# EAGLE design Ardev version 3 (EAGLE 6.4)
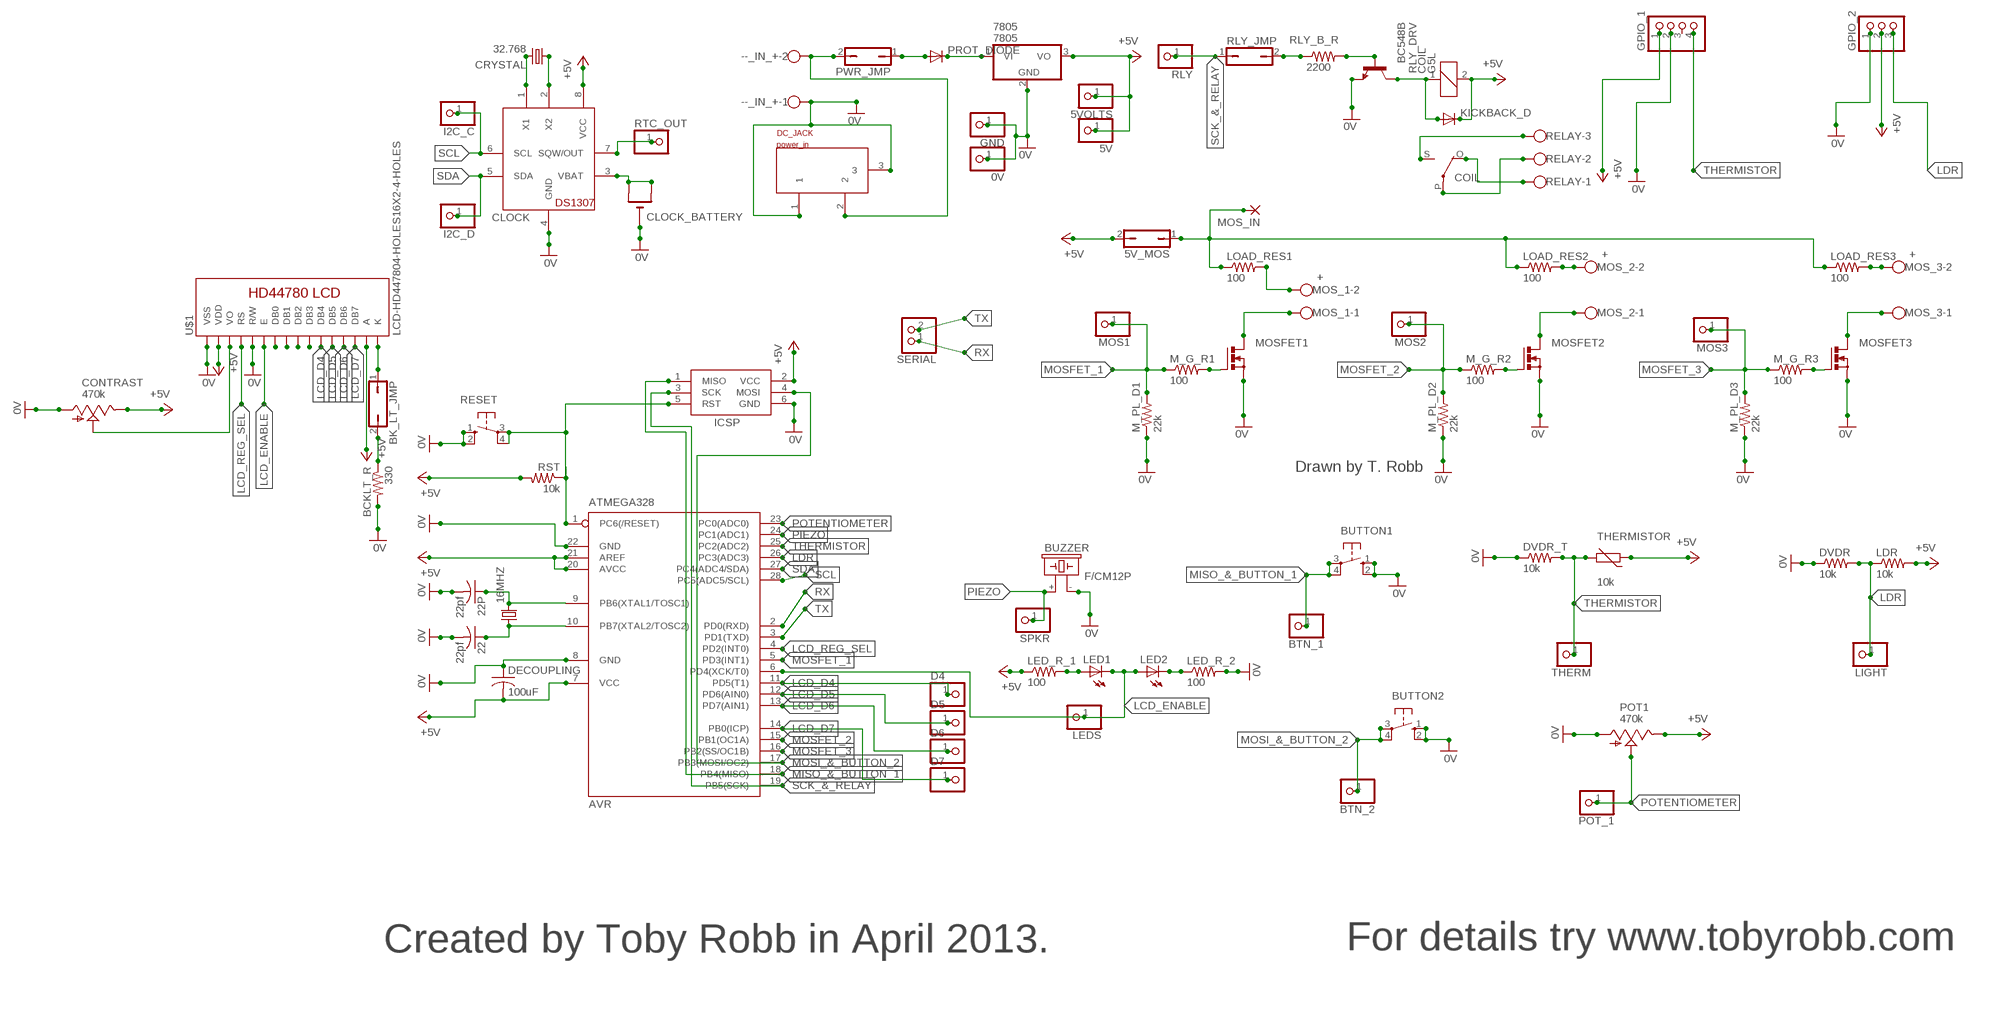
[diagram p0: schematic, sheet 1, part 1 of 2]
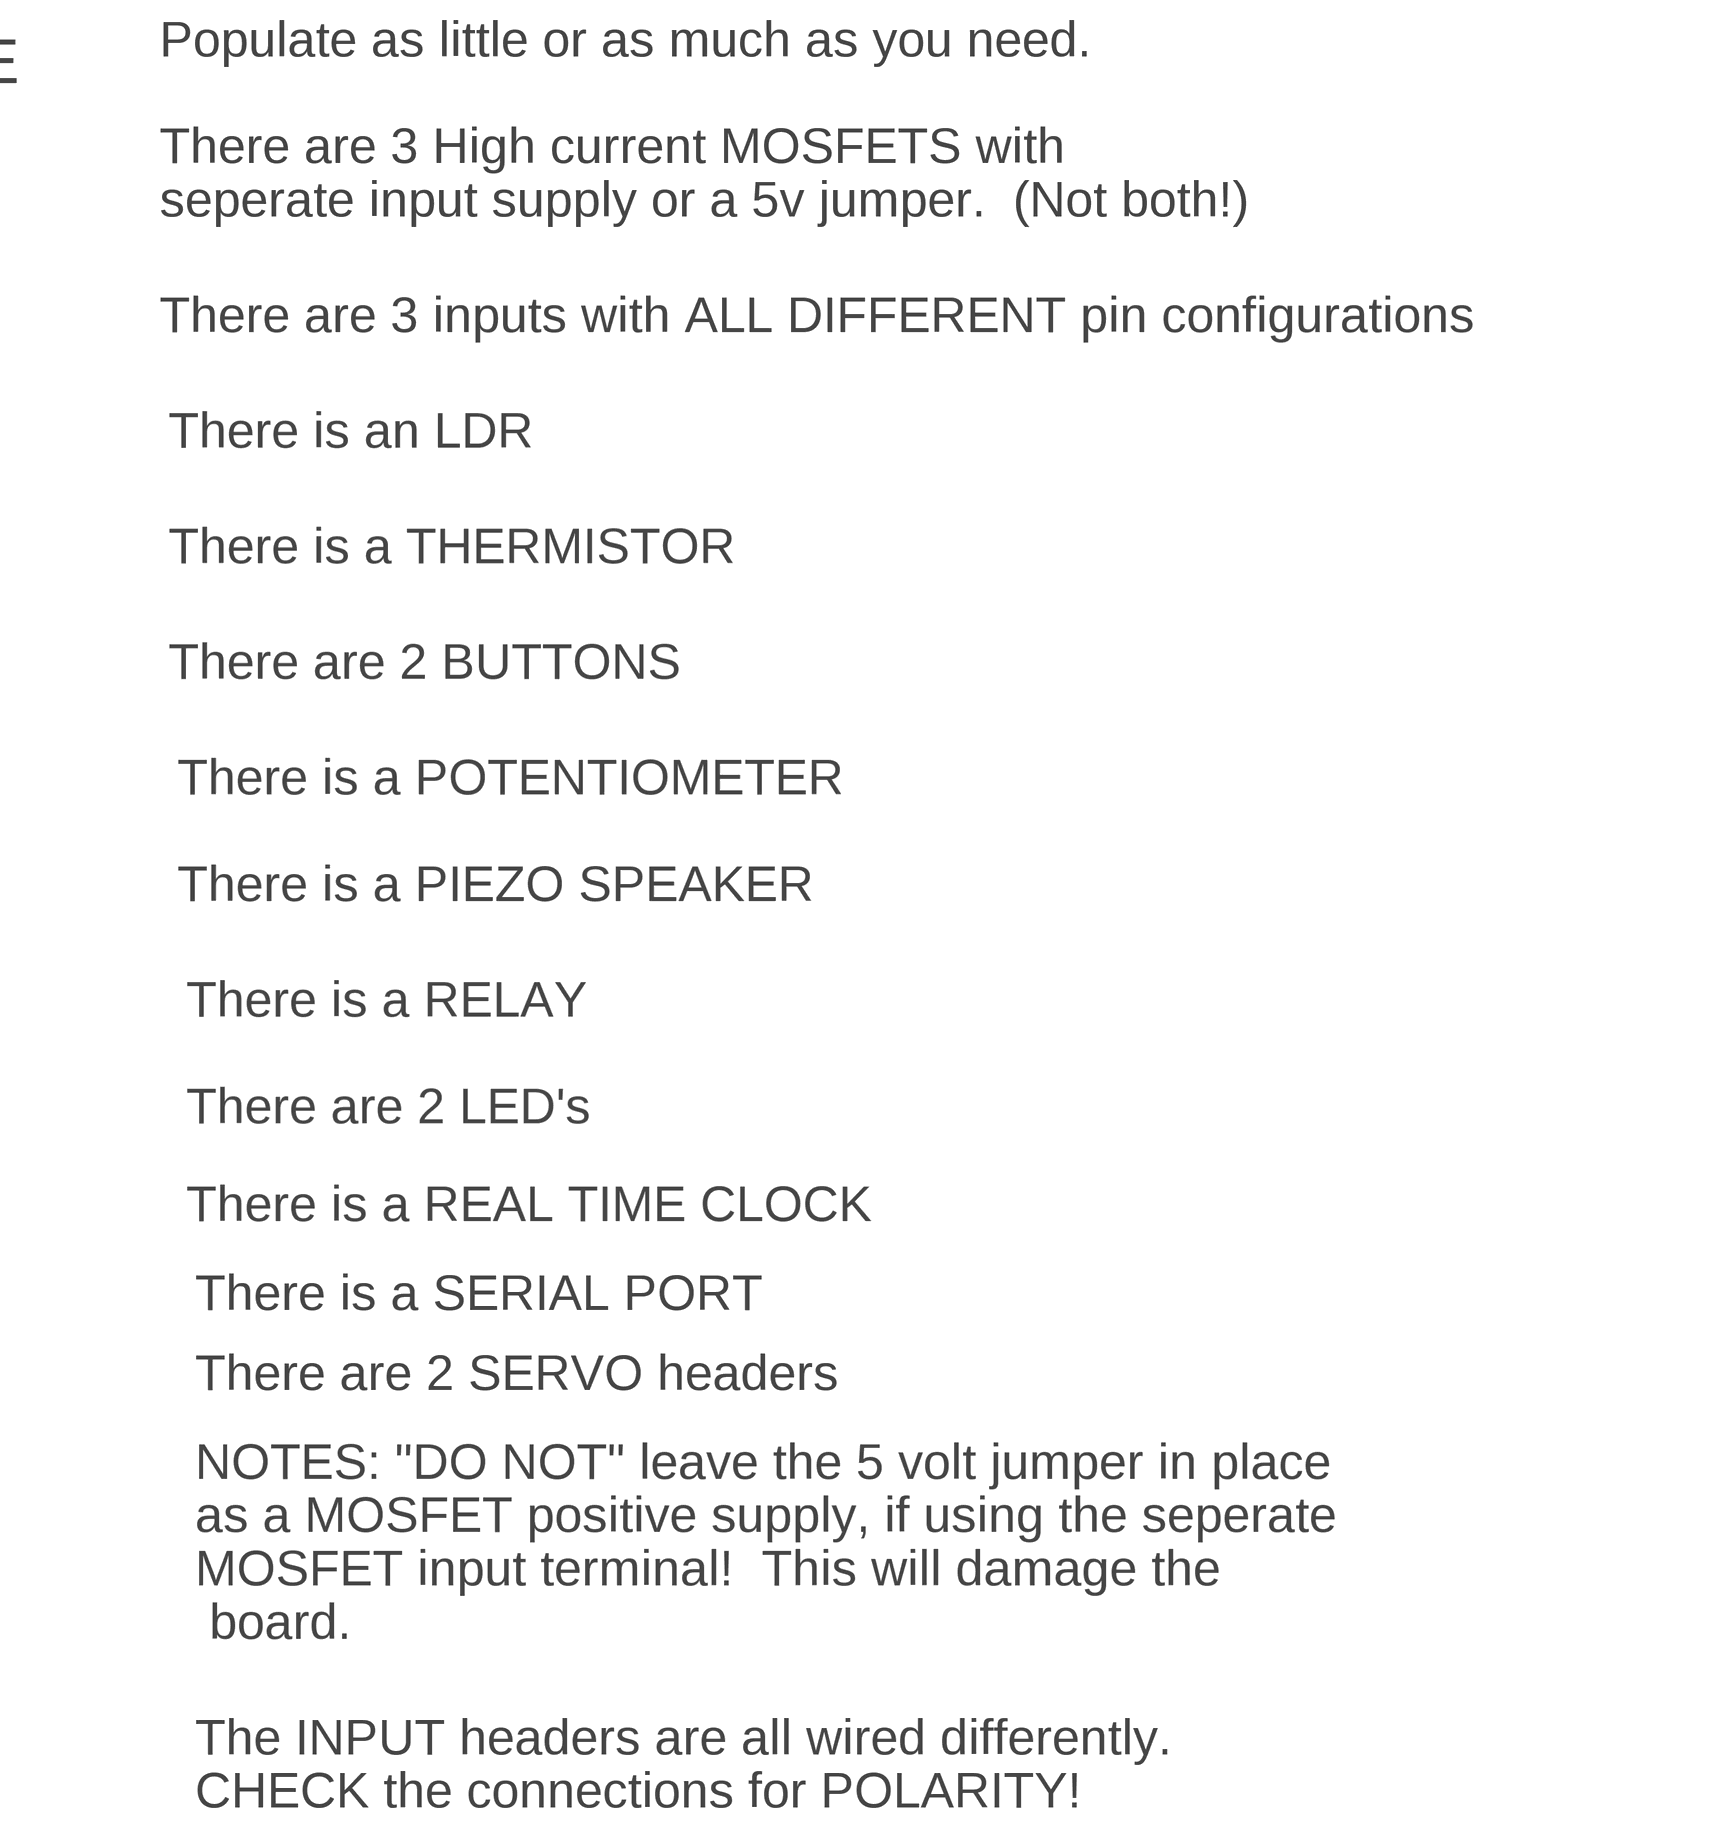
[diagram p1: schematic, sheet 1, part 2 of 2]

## Parts
0V  PINHD-1X1  [1X01]
5V  PINHD-1X1  [1X01]
5V_MOS  JP1Q  [JP1]
5VOLTS  PINHD-1X1  [1X01]
16MHZ  CRYSTALHC49U-V  [HC49U-V]
22  22pf  C-US025-050X050  [C025-050X050]
22P  22pf  C-US025-050X050  [C025-050X050]
7805  7805  7805TV  [TO220V]
--_IN_+  W237-102  [W237-102]
AVR  ATMEGA328  MEGA8-P  [DIL28-3]
BCKLT_R  330  R-US_0309/V  [0309V]
BK_LT_JMP  JP1Q  [JP1]
BTN_1  PINHD-1X1  [1X01]
BTN_2  PINHD-1X1  [1X01]
BUTTON1  10-XX  [B3F-10XX]
BUTTON2  10-XX  [B3F-10XX]
BUZZER  F/CM12P  [F/CM12P]
CLOCK  DS1307  [DIL08]
CLOCK_BATTERY  CR1220THM  [CR1220-THM]
COIL  G5L  [G5LE]
CONTRAST  470k  TRIM_US-CA6V  [CA6V]
CRYSTAL  32.768  CRYSTALTC26H  [TC26H]
D4  PINHD-1X1  [1X01]
D5  PINHD-1X1  [1X01]
D6  PINHD-1X1  [1X01]
D7  PINHD-1X1  [1X01]
DC_JACK  power_in  SMARTPRJ_POWERSUPPLY_DC21MMX  [SMARTPRJ_POWERSUPPLY_DC-21MM]
DECOUPLING  100uF  C-US025-050X050  [C025-050X050]
DVDR  10k  R-US_0309/V  [0309V]
DVDR_T  10k  R-US_0309/V  [0309V]
GND  PINHD-1X1  [1X01]
GPIO_1  PINHD-1X4  [1X04]
GPIO_2  PINHD-1X3  [1X03]
I2C_C  PINHD-1X1  [1X01]
I2C_D  PINHD-1X1  [1X01]
ICSP  AVRISP-6  [AVRISP]
KICKBACK_D  DIODE-D-7.5  [D-7.5]
LDR  10k  R-US_0309/V  [0309V]
LED1  LED5MM  [LED5MM]
LED2  LED5MM  [LED5MM]
LED_R_1  100  R-US_0207/2V  [0207/2V]
LED_R_2  100  R-US_0207/2V  [0207/2V]
LEDS  PINHD-1X1  [1X01]
LIGHT  PINHD-1X1  [1X01]
LOAD_RES1  100  R-US_0309/V  [0309V]
LOAD_RES2  100  R-US_0309/V  [0309V]
LOAD_RES3  100  R-US_0309/V  [0309V]
M_G_R1  100  R-US_0309/V  [0309V]
M_G_R2  100  R-US_0309/V  [0309V]
M_G_R3  100  R-US_0309/V  [0309V]
M_PL_D1  22k  R-US_0309/V  [0309V]
M_PL_D2  22k  R-US_0309/V  [0309V]
M_PL_D3  22k  R-US_0309/V  [0309V]
MOS1  PINHD-1X1  [1X01]
MOS2  PINHD-1X1  [1X01]
MOS3  PINHD-1X1  [1X01]
MOS_1  +  W237-102  [W237-102]
MOS_2  +  W237-102  [W237-102]
MOS_3  +  W237-102  [W237-102]
MOS_IN  3,17/1,3  [3,17/1,3]
MOSFET1  IRF512  [TO220BV]
MOSFET2  IRF512  [TO220BV]
MOSFET3  IRF512  [TO220BV]
POT1  470k  TRIM_US-CA6V  [CA6V]
POT_1  PINHD-1X1  [1X01]
PROT_DIODE  DIODE-D-7.5  [D-7.5]
PWR_JMP  JP1Q  [JP1]
RELAY  W237-103  [W237-103]
RESET  10-XX  [B3F-10XX]
RLY  PINHD-1X1  [1X01]
RLY_B_R  2200  R-US_0309/V  [0309V]
RLY_DRV  BC548B  [TO92-EBC]
RLY_JMP  JP1Q  [JP1]
RST  10k  R-US_0309/V  [0309V]
RTC_OUT  PINHD-1X1  [1X01]
SERIAL  PINHD-1X2  [1X02]
SPKR  PINHD-1X1  [1X01]
THERM  PINHD-1X1  [1X01]
THERMISTOR  10k  THERMISTOR_R-2,5  [RS-2,5]
U$1  LCD-HD447804-HOLES16X2-4-HOLES  [LCD-16X2-4HOLES]

## Nets
0V: 0V.1 22.2 22P.2 7805.2(GND) --_IN_+.1 AVR.8(GND) AVR.22(GND) BCKLT_R.2 BUTTON1.1(S) BUTTON1.2(S1) BUTTON2.1(S) BUTTON2.2(S1) BUZZER.- CLOCK.4(GND) CLOCK_BATTERY.- CONTRAST.A DC_JACK.1 DC_JACK.3 DECOUPLING.1 DVDR.1 DVDR_T.1 GND.1 GPIO_1.2 GPIO_2.1 ICSP.6(GND) LED_R_2.2 M_PL_D1.1 M_PL_D2.1 M_PL_D3.1 MOSFET1.S MOSFET2.S MOSFET3.S POT1.A RESET.1(S) RESET.2(S1) RLY_DRV.E U$1.1(VSS) U$1.5(R/W)
+5V: 5V.1 5V_MOS.2 5VOLTS.1 7805.3(VO) AVR.7(VCC) AVR.20(AVCC) AVR.21(AREF) CLOCK.8(VCC) COIL.2 CONTRAST.E DECOUPLING.2 GPIO_1.1 GPIO_2.2 ICSP.2(VCC) KICKBACK_D.C LDR.2 LED_R_1.1 POT1.E RST.2 THERMISTOR.1 U$1.2(VDD) U$1.15(A)
LCD_D4: AVR.11(PD5(T1)) D4.1 U$1.11(DB4)
LCD_D5: AVR.12(PD6(AIN0)) D5.1 U$1.12(DB5)
LCD_D6: AVR.13(PD7(AIN1)) D6.1 U$1.13(DB6)
LCD_D7: AVR.14(PB0(ICP)) D7.1 U$1.14(DB7)
LCD_ENABLE: AVR.6(PD4(XCK/T0)) LED1.K(C) LED2.A LEDS.1 U$1.6(E)
LCD_REG_SEL: AVR.4(PD2(INT0)) U$1.4(RS)
LDR: AVR.26(PC3(ADC3)) DVDR.2 GPIO_2.3 LDR.1 LIGHT.1
MISO_&_BUTTON_1: AVR.18(PB4(MISO)) BTN_1.1 BUTTON1.3(P) BUTTON1.4(P1) ICSP.1(MISO)
MOSFET_1: AVR.5(PD3(INT1)) M_G_R1.1 M_PL_D1.2 MOS1.1
MOSFET_2: AVR.15(PB1(OC1A)) M_G_R2.1 M_PL_D2.2 MOS2.1
MOSFET_3: AVR.16(PB2(SS/OC1B)) M_G_R3.1 M_PL_D3.2 MOS3.1
MOSI_&_BUTTON_2: AVR.17(PB3(MOSI/OC2)) BTN_2.1 BUTTON2.3(P) BUTTON2.4(P1) ICSP.4(MOSI)
N$1: --_IN_+.2 DC_JACK.2 PWR_JMP.2
N$2: PROT_DIODE.A PWR_JMP.1
N$3: AVR.1(PC6(/RESET)) ICSP.5(RST) RESET.3(P) RESET.4(P1) RST.1
N$4: 7805.1(VI) PROT_DIODE.C
N$5: LOAD_RES1.2 MOS_1.2
N$6: MOS_1.1 MOSFET1.D
N$7: 16MHZ.2 22P.1 AVR.9(PB6(XTAL1/TOSC1))
N$8: LOAD_RES3.2 MOS_3.2
N$9: MOS_3.1 MOSFET3.D
N$10: 16MHZ.1 22.1 AVR.10(PB7(XTAL2/TOSC2))
N$11: LOAD_RES2.2 MOS_2.2
N$12: MOS_2.1 MOSFET2.D
N$13: CLOCK.2(X2) CRYSTAL.1
N$14: CLOCK.1(X1) CRYSTAL.2
N$15: CLOCK.3(VBAT) CLOCK_BATTERY.+1(+) CLOCK_BATTERY.+2(+1)
N$16: LED1.A LED_R_1.2
N$17: COIL.O(2:O) RELAY.1
N$18: COIL.P(2:P) RELAY.2
N$19: COIL.S(2:S) RELAY.3
N$20: 5V_MOS.1 LOAD_RES1.1 LOAD_RES2.1 LOAD_RES3.1 MOS_IN.1(P)
N$21: LED2.K(C) LED_R_2.1
N$22: CLOCK.7(SQW/OUT) RTC_OUT.1
N$23: COIL.1 KICKBACK_D.A RLY_DRV.C
N$24: M_G_R3.2 MOSFET3.G
N$25: CONTRAST.S U$1.3(VO)
N$26: U$1.7(DB0)
N$27: U$1.8(DB1)
N$28: U$1.9(DB2)
N$29: U$1.10(DB3)
N$30: M_G_R2.2 MOSFET2.G
N$31: M_G_R1.2 MOSFET1.G
N$32: BK_LT_JMP.1 U$1.16(K)
N$33: BCKLT_R.1 BK_LT_JMP.2
N$34: RLY_B_R.2 RLY_DRV.B
N$35: RLY_B_R.1 RLY_JMP.2
PIEZO: AVR.24(PC1(ADC1)) BUZZER.+ SPKR.1
POTENTIOMETER: AVR.23(PC0(ADC0)) POT1.S POT_1.1
RX: AVR.2(PD0(RXD)) SERIAL.1
SCK_&_RELAY: AVR.19(PB5(SCK)) ICSP.3(SCK) RLY.1 RLY_JMP.1
SCL: AVR.28(PC5(ADC5/SCL)) CLOCK.6(SCL) I2C_C.1
SDA: AVR.27(PC4(ADC4/SDA)) CLOCK.5(SDA) I2C_D.1
THERMISTOR: AVR.25(PC2(ADC2)) DVDR_T.2 GPIO_1.4 THERM.1 THERMISTOR.2
TX: AVR.3(PD1(TXD)) SERIAL.2
Unconnected: GPIO_1.3

## Notes on the sheet
- This is a development board for the ATMEGA328 programmed through the ARDUINO IDE
- Populate as little or as much as you need.
  
  There are 3 High current MOSFETS with
  seperate input supply or a 5v jumper.
- (Not both!)
- There are 3 inputs with ALL DIFFERENT pin configurations
- There is an LDR
- There is a THERMISTOR
- There are 2 BUTTONS
- There is a POTENTIOMETER
- There is a PIEZO SPEAKER
- Drawn by T. Robb | There is a RELAY
- There are 2 LED's
- There is a REAL TIME CLOCK
- There is a SERIAL PORT
- There are 2 SERVO headers
- NOTES: "DO NOT" leave the 5 volt jumper in place
  as a MOSFET positive supply, if using the seperate
  MOSFET input terminal!  This will damage the
   board.
- For details try www.tobyrobb.com
- The INPUT headers are all wired differently.
  CHECK the connections for POLARITY!
- Created by Toby Robb in April 2013.

## Library data of the parts
0V 5V 5VOLTS BTN_1 BTN_2 D4-D7 GND I2C_C I2C_D LEDS LIGHT MOS1-MOS3 POT_1 RLY RTC_OUT SPKR THERM = pinhead:PINHD-1X1: PIN HEADER
5V_MOS BK_LT_JMP PWR_JMP RLY_JMP = jumper:JP1Q: JUMPER
16MHZ = crystal:CRYSTAL: CRYSTAL; OC_FARNELL: 1666969; OC_NEWARK: unknown
22 22P DECOUPLING = rcl:C-US: CAPACITOR, American symbol
7805 = linear:78*: Positive VOLTAGE REGULATOR Source: http://cache.national.com/ds/LM/LM78L05.pdf http://www.fairchildsemi.com/ds/LM/LM7805.pdf
--_IN_+ MOS_1-MOS_3 = con-wago-500:W237-102: WAGO SCREW CLAMP; MPN: 237-102; OC_FARNELL: unknown; OC_NEWARK: 70K9898
AVR = atmel:MEGA8-P: MICROCONTROLLER 8 Kbytes FLASH, 1 kbytes SRAM, 512 bytes EEPROM, USART, 4-channel 10 bit ADC, 2-channel 8 bit ADC Pin compatible with Atmega48, ATMega88, ATMega168 Source: avr.lbr; OC_FARNELL: unknown; OC_NEWARK: unknown
BCKLT_R DVDR DVDR_T LDR LED_R_1 LED_R_2 LOAD_RES1-LOAD_RES3 M_G_R1-M_G_R3 M_PL_D1-M_PL_D3 RLY_B_R RST = rcl:R-US_: RESISTOR, American symbol
BUTTON1 BUTTON2 RESET = switch-omron:10-XX: OMRON SWITCH; MPN: B3F-1000; OC_FARNELL: 176432; OC_NEWARK: 36M3542
BUZZER = buzzer:F/CM12P: BUZZER Source: Buerklin; OC_FARNELL: unknown; OC_NEWARK: unknown
CLOCK = adafruit:DS1307: DS1307 Real time clock (RTC) with battery backup ability. Talk to it via i2c
CLOCK_BATTERY = adafruit:CR1220: CR1216/CR1220/CR1225 12mm 3V lithium coin cell Great for battery packup. Both SMT and THM holders. Note the THM package has the ground pads on both sides of the PCB so that the masks are the same - this reduces the cost
COIL = relay:G5L: RELAY 1 x switch, 10 A/120 V AC, 8 A/30 V ADC, Omron; OC_FARNELL: unknown; OC_NEWARK: unknown
CONTRAST POT1 = pot:TRIM_US-: POTENTIOMETER
CRYSTAL = crystal:CRYSTAL: CRYSTAL; OC_FARNELL: unknown; OC_NEWARK: unknown
DC_JACK = arduino_Uno_Rev3-02-TH:SMARTPRJ_POWERSUPPLY_DC21MM
GPIO_1 = pinhead:PINHD-1X4: PIN HEADER
GPIO_2 = pinhead:PINHD-1X3: PIN HEADER
ICSP = adafruit:AVRISP: AVR ISP HEADER Standard 6 pin header for AVR programming
KICKBACK_D PROT_DIODE = diode:DIODE-: DIODE
LED1 LED2 = led:LED: LED OSRAM: - CHIPLED LG R971, LG N971, LY N971, LG Q971, LY Q971, LO R971, LY R971 LH N974, LH R974 LS Q976, LO Q976, LY Q976 LO Q996 - Hyper CHIPLED LW Q18S LB Q993, LB Q99A, LB R99A - SideLED LS A670, LO A670, LY A670, LG A670, LP A670 LB A673, LV A673, LT A673, LW A673 LH A674 LY A675 LS A676, LA A676, LO A676, LY A676, LW A676 LS A679, LY A679, LG A679 - Hyper Micro SIDELED® LS Y876, LA Y876, LO Y876, LY Y876 LT Y87S - SmartLED LW L88C, LW L88S LB L89C, LB L89S, LG L890 LS L89K, LO L89K, LY L89K LS L896, LA L896, LO L896, LY L896 - TOPLED LS T670, LO T670, LY T670, LG T670, LP T670 LSG T670, LSP T670, LSY T670, LOP T670, LYG T670 LG T671, LOG T671, LSG T671 LB T673, LV T673, LT T673, LW T673 LH T674 LS T676, LA T676, LO T676, LY T676, LB T676, LH T676, LSB T676, LW T676 LB T67C, LV T67C, LT T67C, LS T67K, LO T67K, LY T67K, LW E67C LS E67B, LA E67B, LO E67B, LY E67B, LB E67C, LV E67C, LT E67C LW T67C LS T679, LY T679, LG T679 LS T770, LO T770, LY T770, LG T770, LP T770 LB T773, LV T773, LT T773, LW T773 LH T774 LS E675, LA E675, LY E675, LS T675 LS T776, LA T776, LO T776, LY T776, LB T776 LHGB T686 LT T68C, LB T68C - Hyper Mini TOPLED® LB M676 - Mini TOPLED Santana® LG M470 LS M47K, LO M47K, LY M47K Source: http://www.osram.convergy.de LUXEON: - LUMILED® LXK2-PW12-R00, LXK2-PW12-S00, LXK2-PW14-U00, LXK2-PW14-V00 LXK2-PM12-R00, LXK2-PM12-S00, LXK2-PM14-U00 LXK2-PE12-Q00, LXK2-PE12-R00, LXK2-PE12-S00, LXK2-PE14-T00, LXK2-PE14-U00 LXK2-PB12-K00, LXK2-PB12-L00, LXK2-PB12-M00, LXK2-PB14-N00, LXK2-PB14-P00, LXK2-PB14-Q00 LXK2-PR12-L00, LXK2-PR12-M00, LXK2-PR14-Q00, LXK2-PR14-R00 LXK2-PD12-Q00, LXK2-PD12-R00, LXK2-PD12-S00 LXK2-PH12-R00, LXK2-PH12-S00 LXK2-PL12-P00, LXK2-PL12-Q00, LXK2-PL12-R00 Source: www.luxeon.com KINGBRIGHT: KA-3528ASYC Source: www.kingbright.com
MOS_IN = wirepad:3,17/1,3: THROUGH-HOLE PAD
MOSFET1-MOSFET3 = transistor-power:IRF512: N-CHANNEL MOS FET
RELAY = con-wago-500:W237-103: WAGO SCREW CLAMP; MPN: 237-103; OC_FARNELL: unknown; OC_NEWARK: 18M7116
RLY_DRV = transistor-npn:BC548*: NPN Transistor
SERIAL = pinhead:PINHD-1X2: PIN HEADER
THERMISTOR = discrete:THERMISTOR_: Thermo Resistor
U$1 = HD44780LCD:LCD-HD44780

## Net classes
0 default: clearance 0.355 mm

## Board
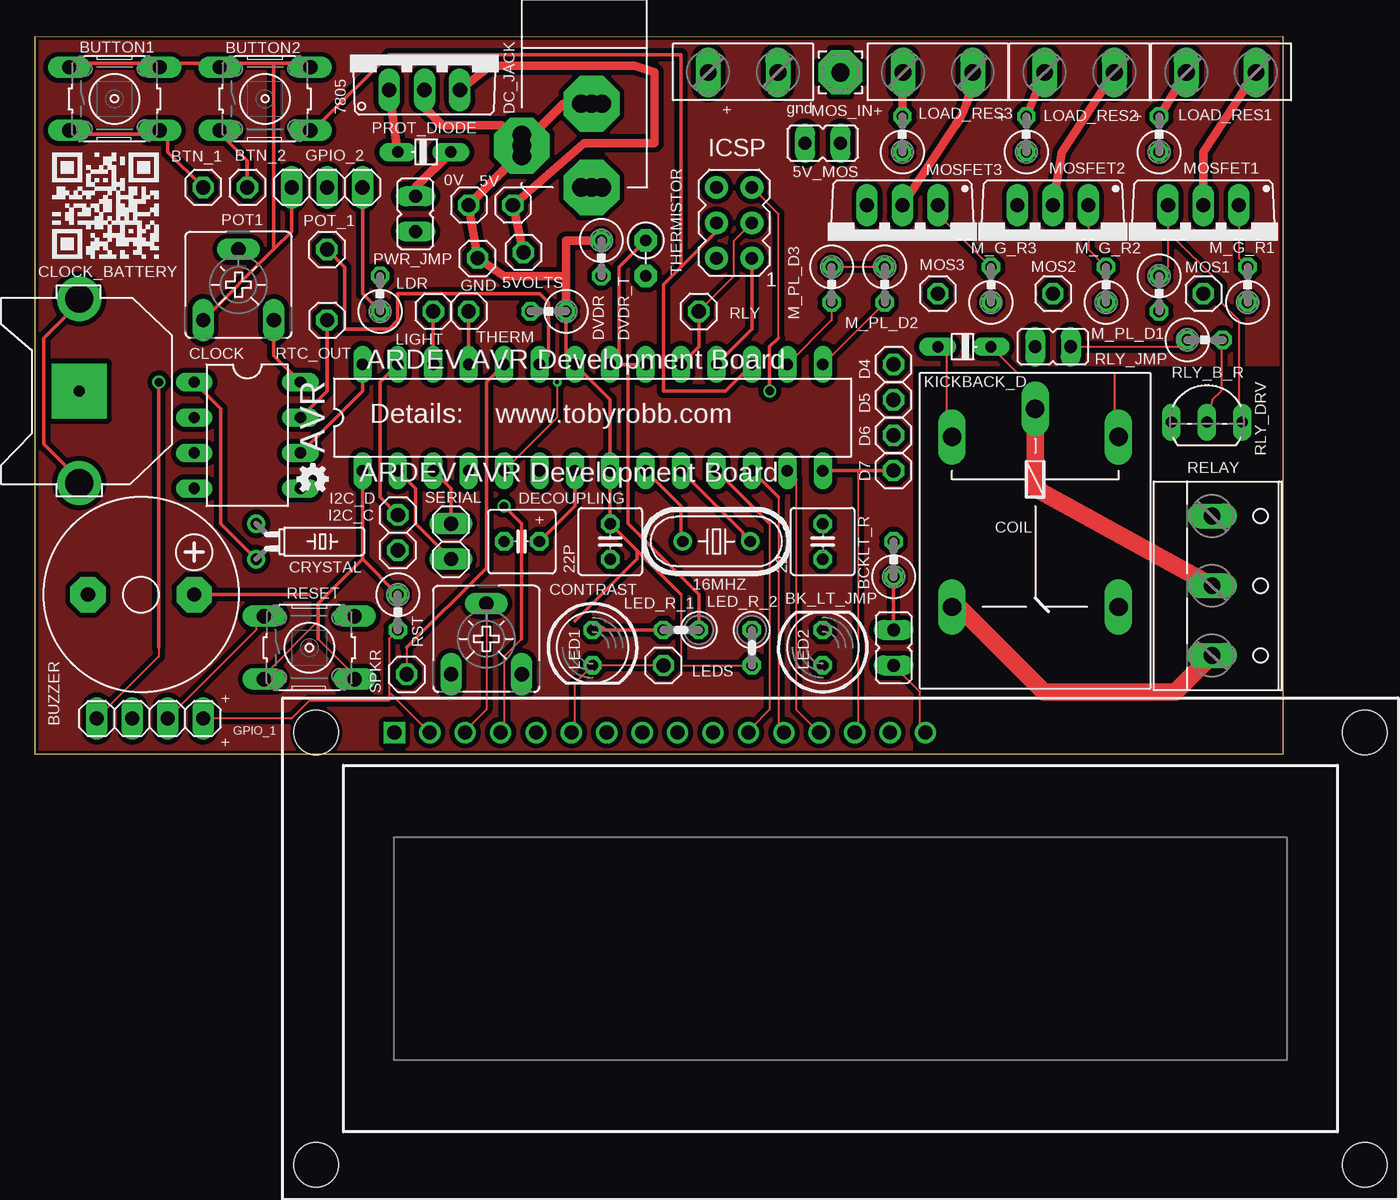
[diagram p2: board, top side]
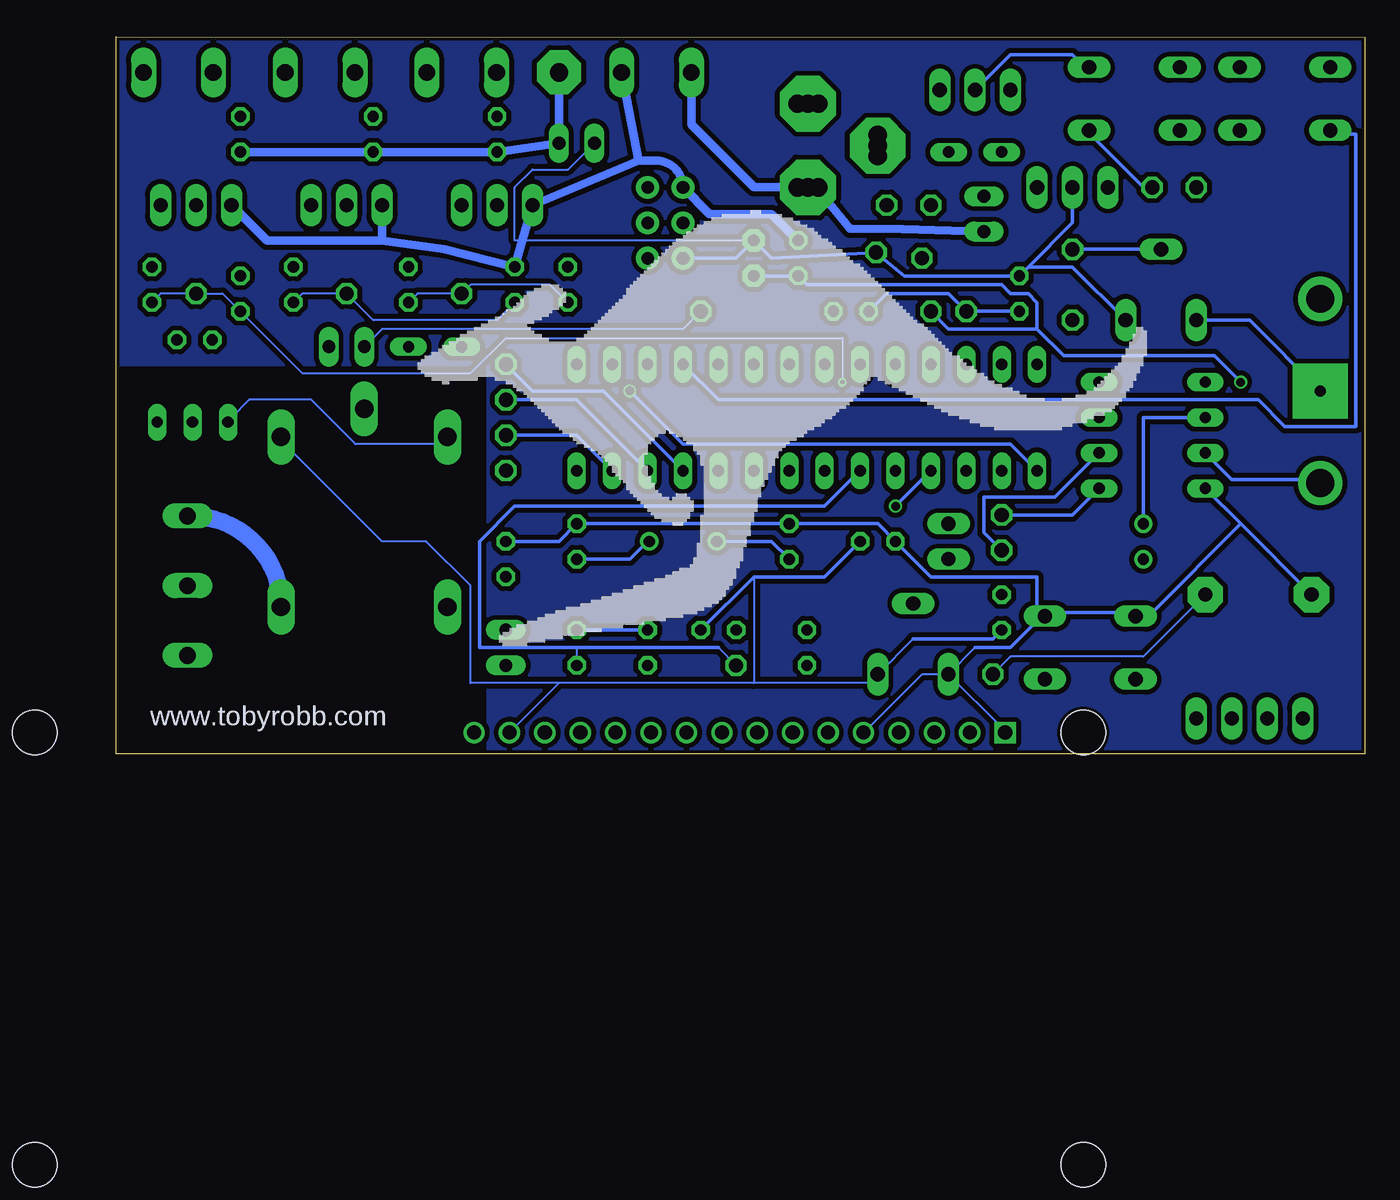
[diagram p3: board, bottom side, seen from below]

Size 89.53 x 51.44 mm. Coordinates in mm from the lower left corner, seen from the top.
Outline: 0,0 89.53,0 89.53,51.44 0,51.42 0,0
Copper layers (1*16): Top 0.035mm / dielectric 1.5mm / Bottom 0.035mm
Design rules "ITEADstudio_DRC": minimum track width 6mil, minimum drill 12mil, track to track 6mil, track to pad 6mil, pad to pad 6mil, via to via 6mil, smd to smd 0mil, copper to edge 10mil, drill to drill 10mil, minimum pad ring 10mil, minimum via ring 6mil, stop-mask expansion 2mil, vias tented up to drill 100mil, thermal gap 10mil

### Footprints (pad centres in the part's own frame; a part is rotated, then mirrored left to right if it is on the bottom)
1X01 = drill 1.016 octagon: 1 0,0
JP1 = drill 0.914 long: 1 0,-1.27; 2 0,1.27
HC49U-V = drill 0.813: 1 -2.413,0; 2 2.413,0
C025-050X050 = drill 0.813 octagon: 1 -1.27,0; 2 1.27,0
TO220V = drill 1.016 long: 1 -2.54,-2.54; 2 0,-2.54; 3 2.54,-2.54
W237-102 = drill 1.194 long: 1 -2.5,-1.27; 2 2.5,-1.27
DIL28-3 = drill 0.813 long: 1 -16.51,-3.81; 2 -13.97,-3.81; 3 -11.43,-3.81; 4 -8.89,-3.81; 5 -6.35,-3.81; 6 -3.81,-3.81; 7 -1.27,-3.81; 8 1.27,-3.81; 9 3.81,-3.81; 10 6.35,-3.81; 11 8.89,-3.81; 12 11.43,-3.81; 13 13.97,-3.81; 14 16.51,-3.81; 15 16.51,3.81; 16 13.97,3.81; 17 11.43,3.81; 18 8.89,3.81; 19 6.35,3.81; 20 3.81,3.81; 21 1.27,3.81; 22 -1.27,3.81; 23 -3.81,3.81; 24 -6.35,3.81; 25 -8.89,3.81; 26 -11.43,3.81; 27 -13.97,3.81; 28 -16.51,3.81
0309V = drill 0.813 octagon: 1 -1.27,0; 2 1.27,0
B3F-10XX = drill 1.016 long: 1 -3.251,2.261; 2 3.251,2.261; 3 -3.251,-2.261; 4 3.251,-2.261
F/CM12P = drill 1.016 pad 2.54 octagon: + 3.81,0; - -3.81,0
DIL08 = drill 0.813 long: 1 -3.81,-3.81; 2 -1.27,-3.81; 3 1.27,-3.81; 4 3.81,-3.81; 5 3.81,3.81; 6 1.27,3.81; 7 -1.27,3.81; 8 -3.81,3.81
CR1220-THM = drill 2 pad 3.175: +1 -6.604,0; +2 6.604,0 | drill 0.8 pad 3.962 square: - 0,0
G5LE = drill 1.321 long: 1 -7.493,-5.969; 2 -7.493,5.969; O 4.699,5.969; P -9.525,0; S 4.699,-5.969
CA6V = drill 1.016 long: A -2.54,-2.54; E 2.54,-2.54; S 0,2.54
TC26H = drill 0.813: 1 -1.27,0; 2 1.27,0
SMARTPRJ_POWERSUPPLY_DC-21MM = drill 1.3 pad 4 octagon: 1 -5.08,-3.353; 2 -0.076,-6.35; 3 -0.076,-0.356 | drill 1.3: 4 -5.08,-4.115; 5 -5.08,-2.591; 6 -0.838,-0.356; 7 0.686,-0.356; 8 -0.838,-6.35; 9 0.686,-6.35
1X04 = drill 1.016 long: 1 -3.81,0; 2 -1.27,0; 3 1.27,0; 4 3.81,0
1X03 = drill 1.016 long: 1 -2.54,0; 2 0,0; 3 2.54,0
AVRISP = drill 0.9 pad 1.626: 1 -1.27,2.54; 2 1.27,2.54; 3 -1.27,0; 4 1.27,0; 5 -1.27,-2.54; 6 1.27,-2.54
D-7.5 = drill 0.813 long: A 0,0; C -3.81,0
LED5MM = drill 0.813 octagon: A -1.27,0; K 1.27,0
0207/2V = drill 0.813 octagon: 1 -1.27,0; 2 1.27,0
3,17/1,3 = drill 1.321 pad 3.175 octagon: 1 0,0
TO220BV = drill 1.016 long: D 0,-2.54; G -2.54,-2.54; S 2.54,-2.54
W237-103 = drill 1.194 long: 1 -5,-1.29; 2 0,-1.29; 3 5,-1.29
TO92-EBC = drill 0.813 long: B 0,-1.27; C -2.54,-1.27; E 2.54,-1.27
1X02 = drill 1.016 long: 1 -1.27,0; 2 1.27,0
RS-2,5 = drill 0.813 pad 1.6 octagon: 1 -1.27,0; 2 1.27,0
LCD-16X2-4HOLES = drill 1.016 square: 1 -32,15.5 | drill 1.016: 2 -29.46,15.5; 3 -26.92,15.5; 4 -24.38,15.5; 5 -21.84,15.5; 6 -19.3,15.5; 7 -16.76,15.5; 8 -14.22,15.5; 9 -11.68,15.5; 10 -9.14,15.5; 11 -6.6,15.5; 12 -4.06,15.5; 13 -1.52,15.5; 14 1.02,15.5; 15 3.56,15.5; 16 6.1,15.5 | hole 3.2: -37.6,15.5; -37.6,-15.5; 37.6,-15.5; 37.6,15.5

### Placement (x,y rotation side)
0V  31.11,39.37 0 top
5V  34.29,39.37 0 top
5V_MOS  56.52,43.81 90 top
5VOLTS  35.04,35.97 0 top
16MHZ  48.9,15.24 180 top
22  56.52,15.24 90 top
22P  41.27,15.24 90 top
7805  27.94,50.16 0 top
--_IN_+  50.8,47.62 180 top
AVR  40.01,24.13 0 top
BCKLT_R  61.59,13.97 90 top
BK_LT_JMP  61.59,7.62 0 top
BTN_1  12.06,40.64 0 top
BTN_2  15.24,40.64 0 top
BUTTON1  5.71,46.99 0 top
BUTTON2  16.51,46.99 0 top
BUZZER  7.62,11.43 0 top
CLOCK  15.24,22.86 270 top
CLOCK_BATTERY  3.17,26.04 90 top
COIL  71.75,15.24 270 top
CONTRAST  32.38,8.26 0 top
CRYSTAL  15.88,15.24 270 top
D4  61.59,27.94 180 top
D5  61.59,25.4 180 top
D6  61.59,22.86 180 top
D7  61.59,20.32 180 top
DC_JACK  40.01,46.99 0 top
DECOUPLING  34.92,15.24 0 top
DVDR  36.83,31.75 180 top
DVDR_T  40.64,35.56 270 top
GND  31.75,35.56 90 top
GPIO_1  8.26,2.54 180 top
GPIO_2  20.95,40.64 0 top
I2C_C  26.04,14.61 90 top
I2C_D  26.04,17.14 90 top
ICSP  50.16,38.1 180 top
KICKBACK_D  64.77,29.21 180 top
LDR  24.77,33.02 90 top
LED1  40.01,7.62 270 top
LED2  56.52,7.62 90 top
LED_R_1  46.35,8.89 180 top
LED_R_2  51.44,7.62 270 top
LEDS  45.09,6.35 90 top
LIGHT  28.57,31.75 0 top
LOAD_RES1  80.64,44.45 90 top
LOAD_RES2  71.12,44.45 90 top
LOAD_RES3  62.23,44.45 90 top
M_G_R1  87,33.66 90 top
M_G_R2  76.83,33.66 90 top
M_G_R3  68.58,33.66 90 top
M_PL_D1  80.64,33.02 270 top
M_PL_D2  60.96,33.66 270 top
M_PL_D3  57.15,33.66 270 top
MOS1  83.82,33.02 0 top
MOS2  73.03,33.02 0 top
MOS3  64.77,33.02 0 top
MOS_1  85.09,47.62 180 top
MOS_2  74.93,47.62 180 top
MOS_3  64.77,47.62 180 top
MOS_IN  57.78,48.9 0 top
MOSFET1  83.82,36.83 180 top
MOSFET2  73.03,36.83 180 top
MOSFET3  62.23,36.83 180 top
POT1  14.61,33.66 0 top
POT_1  20.95,36.2 90 top
PROT_DIODE  29.84,43.18 0 top
PWR_JMP  27.3,38.73 180 top
RELAY  85.72,12.06 270 top
RESET  19.68,7.62 0 top
RLY  47.62,31.75 90 top
RLY_B_R  83.93,29.69 0 top
RLY_DRV  84.07,25.07 0 top
RLY_JMP  73.03,29.21 270 top
RST  26.04,10.16 270 top
RTC_OUT  20.95,31.11 0 top
SERIAL  29.84,15.24 90 top
SPKR  26.67,5.71 90 top
THERM  31.11,31.75 270 top
THERMISTOR  43.81,35.56 270 top
U$1  57.78,-13.97 0 top

### Tracks (layer width: path | path; a pad name or v marks a point on that pad's centre or on a via)
0V
  Top 0.152: M_PL_D1.1 81.28,34.92 81.28,37.47 | MOSFET1.S 81.28,37.47 | M_PL_D2.1 M_PL_D3.1 | LED_R_2.2 46.35,6.35 46.35,11.43 | GPIO_1.2 15.88,8.89 15.88,9.53 | 81.28,37.47 85.09,33.66 85.09,32.38 86.36,31.11 86.36,24.13 RLY_DRV.E
  Top 0.254: BUTTON1.1 2.54,49.53 8.89,49.53 BUTTON1.2 9.53,49.53 12.7,49.53 BUTTON2.1 13.34,49.53 17.14,49.53 | 17.14,49.53 19.68,49.53 BUTTON2.2 | 17.14,36.2 18.41,37.47 GPIO_2.1 | 17.14,36.2 POT1.A | 17.14,36.2 17.14,49.53 | 15.88,9.53 RESET.1 | DVDR.1 38.1,28.57 AVR.22 41.27,25.4 AVR.8 22P.2 43.18,14.61 | 43.18,14.61 46.35,11.43 | 38.73,9.53 43.18,13.97 43.18,14.61
  Top 0.61: DC_JACK.3 37.92,46.63 DC_JACK.1 | 7805.2 27.94,46.35 29.21,45.09 33.48,45.09 DC_JACK.1 | DC_JACK.1 34.92,43.18 0V.1 GND.1 33.66,34.29 38.1,34.29 | 38.1,34.29 DVDR.1 | DVDR_T.1 38.1,36.83 38.1,34.29
  Bottom 0.152: CONTRAST.A 26.04,1.91 U$1.1 | CONTRAST.A 31.75,5.71 35.56,1.91 U$1.5 | 27.94,7.62 CONTRAST.A
  Bottom 0.254: CLOCK_BATTERY.- 8.26,31.11 POT1.A | BUZZER.- 8.89,16.51 | 8.89,16.51 CLOCK.4 | RESET.2 22.86,10.16 16.51,10.16 RESET.1 15.88,10.16 15.24,10.16 8.89,16.51 | 27.94,7.62 25.4,7.62 23.5,9.53 RESET.2 | BCKLT_R.2 57.78,15.24 22.2 22P.2 34.92,16.51 DECOUPLING.1 31.11,12.7 23.5,12.7 23.5,10.16 RESET.2 | 7805.2 25.4,50.16 20.95,50.16 20.32,49.53 BUTTON2.2
  Bottom 0.61: DVDR_T.1 42.55,38.73 46.99,38.73 ICSP.6 arc-90 50.8,42.55 52.07,42.55 | 52.07,42.55 MOSFET3.S M_PL_D2.1 66.04,36.2 70.48,36.83 | --_IN_+.1 52.07,42.55 | MOSFET1.S 78.74,36.83 70.48,36.83 | 70.48,36.83 MOSFET2.S
+5V
  Top 0.152: 25.4,4.45 27.94,1.91 U$1.2 | 25.4,4.45 25.4,8.26 RST.2 | GPIO_1.1 18.41,2.54 19.68,3.81 25.4,3.81 25.4,4.45 | KICKBACK_D.C 70.48,27.3 77.47,27.3 77.47,22.86 COIL.2
  Top 0.254: CLOCK.8 17.14,28.57 POT1.E | AVR.20 42.55,27.94 | 42.55,27.94 41.91,27.94 | 41.91,27.94 41.91,34.92 THERMISTOR.1 | 41.91,27.94 AVR.21 | DECOUPLING.2 38.73,17.78 AVR.7 | 42.55,27.94 42.55,16.51 47.62,11.43 LED_R_1.1
  Top 0.61: 7805.3 32.68,49.35 43.02,49.35 44.45,48.9 44.45,43.81 39.4,43.8 5V.1 5VOLTS.1
  Bottom 0.152: 5V_MOS.2 57.15,41.91 59.69,41.91 60.96,40.64 60.96,36.83 THERMISTOR.1 | 32.38,8.26 CONTRAST.E 35.56,5.08 43.81,5.08 | 57.78,5.08 60.96,1.91 U$1.15 | 43.81,5.08 57.78,5.08 | 57.78,5.08 64.14,5.08 64.14,12.06 67.31,15.24 70.48,15.24 77.47,22.23 COIL.2 | 43.81,12.7 43.81,5.08
  Bottom 0.254: 24.13,34.92 20.95,38.1 GPIO_2.2 | 24.13,34.92 LDR.2 33.02,34.29 5VOLTS.1 42.55,35.56 THERMISTOR.1 45.09,35.56 ICSP.2 | POT1.E 20.95,34.92 24.13,34.92 | LED_R_1.1 43.81,12.7 38.73,12.7 DECOUPLING.2 | RST.2 26.67,8.26 32.38,8.26
GND
  pour Top: 0,0 0,51.44 89.53,51.44 89.53,27.94 62.87,27.94 62.87,0
  pour Bottom: 0,0 0,51.44 89.53,51.44 89.53,27.94 62.87,27.94 62.87,0
LCD_D4
  Top 0.152: 52.7,16.51 52.7,3.17 51.44,1.91 U$1.11
  Top 0.254: AVR.11 52.7,16.51
  Bottom 0.254: AVR.11 54.61,26.04 59.69,26.04 D4.1
LCD_D5
  Top 0.152: 53.34,18.41 53.34,1.91 U$1.12
  Top 0.254: AVR.12 53.34,18.41
  Bottom 0.254: AVR.12 56.52,25.4 D5.1
LCD_D6
  Top 0.152: 54.61,19.68 54.61,3.17 55.88,1.91 U$1.13
  Top 0.254: AVR.13 54.61,19.68
  Bottom 0.254: AVR.13 56.52,22.86 D6.1
LCD_D7
  Top 0.152: 59.05,20.32 59.05,1.91 U$1.14
  Top 0.254: D7.1 59.05,20.32 AVR.14
LCD_ENABLE
  Top 0.152: U$1.6 38.73,1.91 38.73,5.08 LED1.K LEDS.1
  Bottom 0.152: 56.52,7.62 LED2.A | LEDS.1 46.35,7.62
  Bottom 0.254: AVR.6 38.73,17.78 60.96,17.78 63.5,15.24 63.5,7.62 56.52,7.62 46.35,7.62
LCD_REG_SEL  (via drill 0.61)
  Top 0.152: 34.92,8.26 33.66,6.99 33.66,1.91 U$1.4
  Top 0.254: v33.66,17.78 34.92,16.51 34.92,8.26
  Bottom 0.254: v33.66,17.78 AVR.4
LDR
  Top 0.254: LIGHT.1 AVR.26 | GPIO_2.3 23.5,33.02 LDR.1
  Bottom 0.254: LDR.1 LIGHT.1 29.84,33.02 34.29,33.02 DVDR.2
MISO_&_BUTTON_1
  Top 0.254: AVR.18 51.44,30.48 ICSP.1 | BUTTON1.3 2.54,44.45 8.89,44.45 BUTTON1.4 9.53,44.45 9.53,43.18 BTN_1.1
  Bottom 0.254: AVR.18 46.35,25.4 7.62,25.4 5.71,23.5 0.64,23.5 0.64,44.45 1.91,44.45 BUTTON1.3
MOSFET_1  (via drill 0.3)
  Top 0.152: AVR.5 37.47,24.13 v37.47,26.67
  Bottom 0.152: M_G_R1.1 86.36,33.02 MOS1.1 81.92,33.02 M_PL_D1.2 76.2,27.3 64.14,27.3 61.59,29.84 37.47,29.84 v37.47,26.67
MOSFET_2
  Top 0.152: M_PL_D2.2 AVR.15
  Bottom 0.152: M_G_R2.1 76.2,33.02 MOS2.1 71.12,31.11 62.23,31.11 M_PL_D2.2
MOSFET_3
  Top 0.152: AVR.16 57.15,31.11 M_PL_D3.2
  Bottom 0.152: M_G_R3.1 67.94,33.02 MOS3.1 64.14,33.66 58.42,33.66 M_PL_D3.2
MOSI_&_BUTTON_2
  Top 0.254: BTN_2.1 15.24,42.55 13.34,44.45 BUTTON2.3 | AVR.17 49.53,26.04 45.09,26.04 45.09,33.66 46.35,34.92 | 46.35,34.92 48.9,37.47 ICSP.4 | 46.35,34.92 46.35,50.16 25.4,50.16 20.32,45.09 BUTTON2.4
  Bottom 0.254: BTN_2.1 15.88,40.64 19.68,44.45 BUTTON2.4
N$1
  Bottom 0.61: --_IN_+.2 48.3,45.12 43.81,40.64 DC_JACK.2 39.37,40.64 36.92,37.69 33.17,37.64 PWR_JMP.2
N$2
  Top 0.61: PWR_JMP.1 27.3,40.64 PROT_DIODE.A
N$3  (via drill 0.61)
  Top 0.152: 20.32,9.53 16.51,5.71 RESET.3 | 20.32,8.26 22.86,5.71 RESET.4 | ICSP.5 53.34,38.73 53.34,29.84
  Top 0.254: 23.5,13.97 RST.1 | AVR.1 23.5,13.97 | 53.34,29.84 52.7,29.21 v52.7,26.04 | 20.32,8.26 20.32,9.53 20.32,10.79 23.5,13.97
  Bottom 0.254: v52.7,26.04 48.9,22.23 25.4,22.23 AVR.1
N$4
  Top 0.61: PROT_DIODE.C 7805.1
N$5
  Top 0.61: MOS_1.2 LOAD_RES1.2
N$6
  Top 0.61: MOSFET1.D 83.82,43.18 MOS_1.1
N$7
  Top 0.254: AVR.9 46.35,17.78 46.35,15.24 16MHZ.2
  Bottom 0.254: 22P.1 42.55,15.24 16MHZ.2
N$8
  Top 0.152: 62.23,48.9 MOS_3.2
  Top 0.61: 62.23,48.9 LOAD_RES3.2
N$9
  Top 0.61: MOSFET3.D 66.04,45.09 arc32 MOS_3.1
N$10
  Top 0.254: AVR.10 50.8,15.88 50.8,15.24 16MHZ.1
  Bottom 0.254: 22.1 52.7,13.97 51.44,15.24 16MHZ.1
N$11
  Top 0.61: MOS_2.2 LOAD_RES2.2
N$12
  Top 0.61: MOSFET2.D 73.66,43.18 MOS_2.1
N$13
  Bottom 0.254: CRYSTAL.1 15.88,24.13 CLOCK.2
N$14
  Top 0.254: CRYSTAL.2 13.34,16.51 13.34,24.77 CLOCK.1
N$15
  Top 0.254: CLOCK_BATTERY.+2 3.17,32.38 0.64,29.84 0.64,22.23 3.17,19.68 CLOCK_BATTERY.+1
  Bottom 0.254: CLOCK.3 9.53,19.68 3.17,19.68 CLOCK_BATTERY.+1
N$16
  Top 0.254: LED_R_1.2 LED1.A
N$17
  Bottom 1.27: RELAY.1 84.25,17.07 arc90 COIL.O
N$18
  Top 1.27: RELAY.2 71.75,19.05 COIL.P
N$19
  Top 1.27: RELAY.3 81.81,4.45 72.39,4.45 66.29,10.54 COIL.S
N$20
  Bottom 0.61: MOS_IN.1 5V_MOS.1 LOAD_RES3.1 LOAD_RES2.1 LOAD_RES1.1
N$21
  Bottom 0.254: LED2.K LED_R_2.1
N$22
  Top 0.254: CLOCK.7 20.95,26.04 RTC_OUT.1
N$23
  Top 0.152: KICKBACK_D.A 65.41,28.57 65.41,22.86 COIL.1
  Bottom 0.152: RLY_DRV.C 81.28,24.13 80.01,25.4 75.56,25.4 72.39,22.23 66.04,22.23 COIL.1
N$24
  Top 0.152: M_G_R3.2 64.77,38.73 MOSFET3.G
N$25
  Top 0.152: CONTRAST.S 32.38,3.17 31.11,1.91 U$1.3
N$30
  Top 0.152: M_G_R2.2 75.56,36.2 MOSFET2.G
N$31
  Top 0.152: M_G_R1.2 86.36,35.56 MOSFET1.G
N$32
  Top 0.152: BK_LT_JMP.1 63.5,4.45 63.5,1.91 U$1.16
N$33
  Top 0.254: BK_LT_JMP.2 BCKLT_R.1
N$34
  Top 0.152: RLY_DRV.B 84.45,25.4 85.09,26.04 85.09,29.21 RLY_B_R.2
N$35
  Top 0.152: RLY_JMP.2 82.55,29.21 RLY_B_R.1
PIEZO
  Top 0.152: 26.67,7.62 SPKR.1
  Top 0.254: AVR.24 32.38,26.67 32.38,13.34 26.67,7.62 | 19.68,11.43 BUZZER.+
  Bottom 0.152: SPKR.1 25.4,6.99 15.88,6.99 BUZZER.+
POTENTIOMETER
  Top 0.254: AVR.23 36.83,28.57 36.83,32.38 36.2,33.02 26.04,33.02 26.04,31.11 25.4,30.48 22.23,30.48 22.23,34.92 POT_1.1
  Bottom 0.254: POT_1.1 POT1.S
RX
  Top 0.254: AVR.2 27.3,19.05 27.3,16.51 SERIAL.1
SCK_&_RELAY
  Top 0.152: ICSP.3 50.16,36.83 50.16,34.29 RLY.1
  Top 0.254: AVR.19 47.62,29.21 RLY.1
  Bottom 0.152: RLY_JMP.1 70.48,30.48 48.9,30.48 RLY.1
SCL
  Top 0.254: CLOCK.6 23.5,26.04 AVR.28
  Bottom 0.254: I2C_C.1 27.3,15.88 27.3,18.41 22.23,18.41 CLOCK.6
SDA
  Top 0.254: AVR.27 24.77,26.67 24.77,18.41 I2C_D.1
  Bottom 0.254: CLOCK.5 20.95,17.14 I2C_D.1
THERMISTOR  (via drill 0.61)
  Top 0.152: GPIO_1.4 8.89,6.99 8.89,7.62
  Top 0.254: THERM.1 AVR.25 | v8.89,26.67 8.89,7.62
  Bottom 0.254: THERMISTOR.2 DVDR_T.2 40.01,33.66 26.04,33.66 25.4,33.02 24.13,33.02 23.5,32.38 23.5,30.48 | v8.89,26.67 10.79,28.57 21.59,28.57 23.5,30.48 | 23.5,30.48 29.84,30.48 THERM.1
TX
  Top 0.254: AVR.3 29.84,19.05 SERIAL.2

### Text on the board
tPlace: + | gnd | + | + | + | + | + | +
bPlace: www.tobyrobb.com
tNames: ARDEV AVR Development Board | Details: www.tobyrobb.com | ARDEV AVR Development Board